# EAGLE design picoPSU-ATX_V2 (EAGLE 7.7.0)
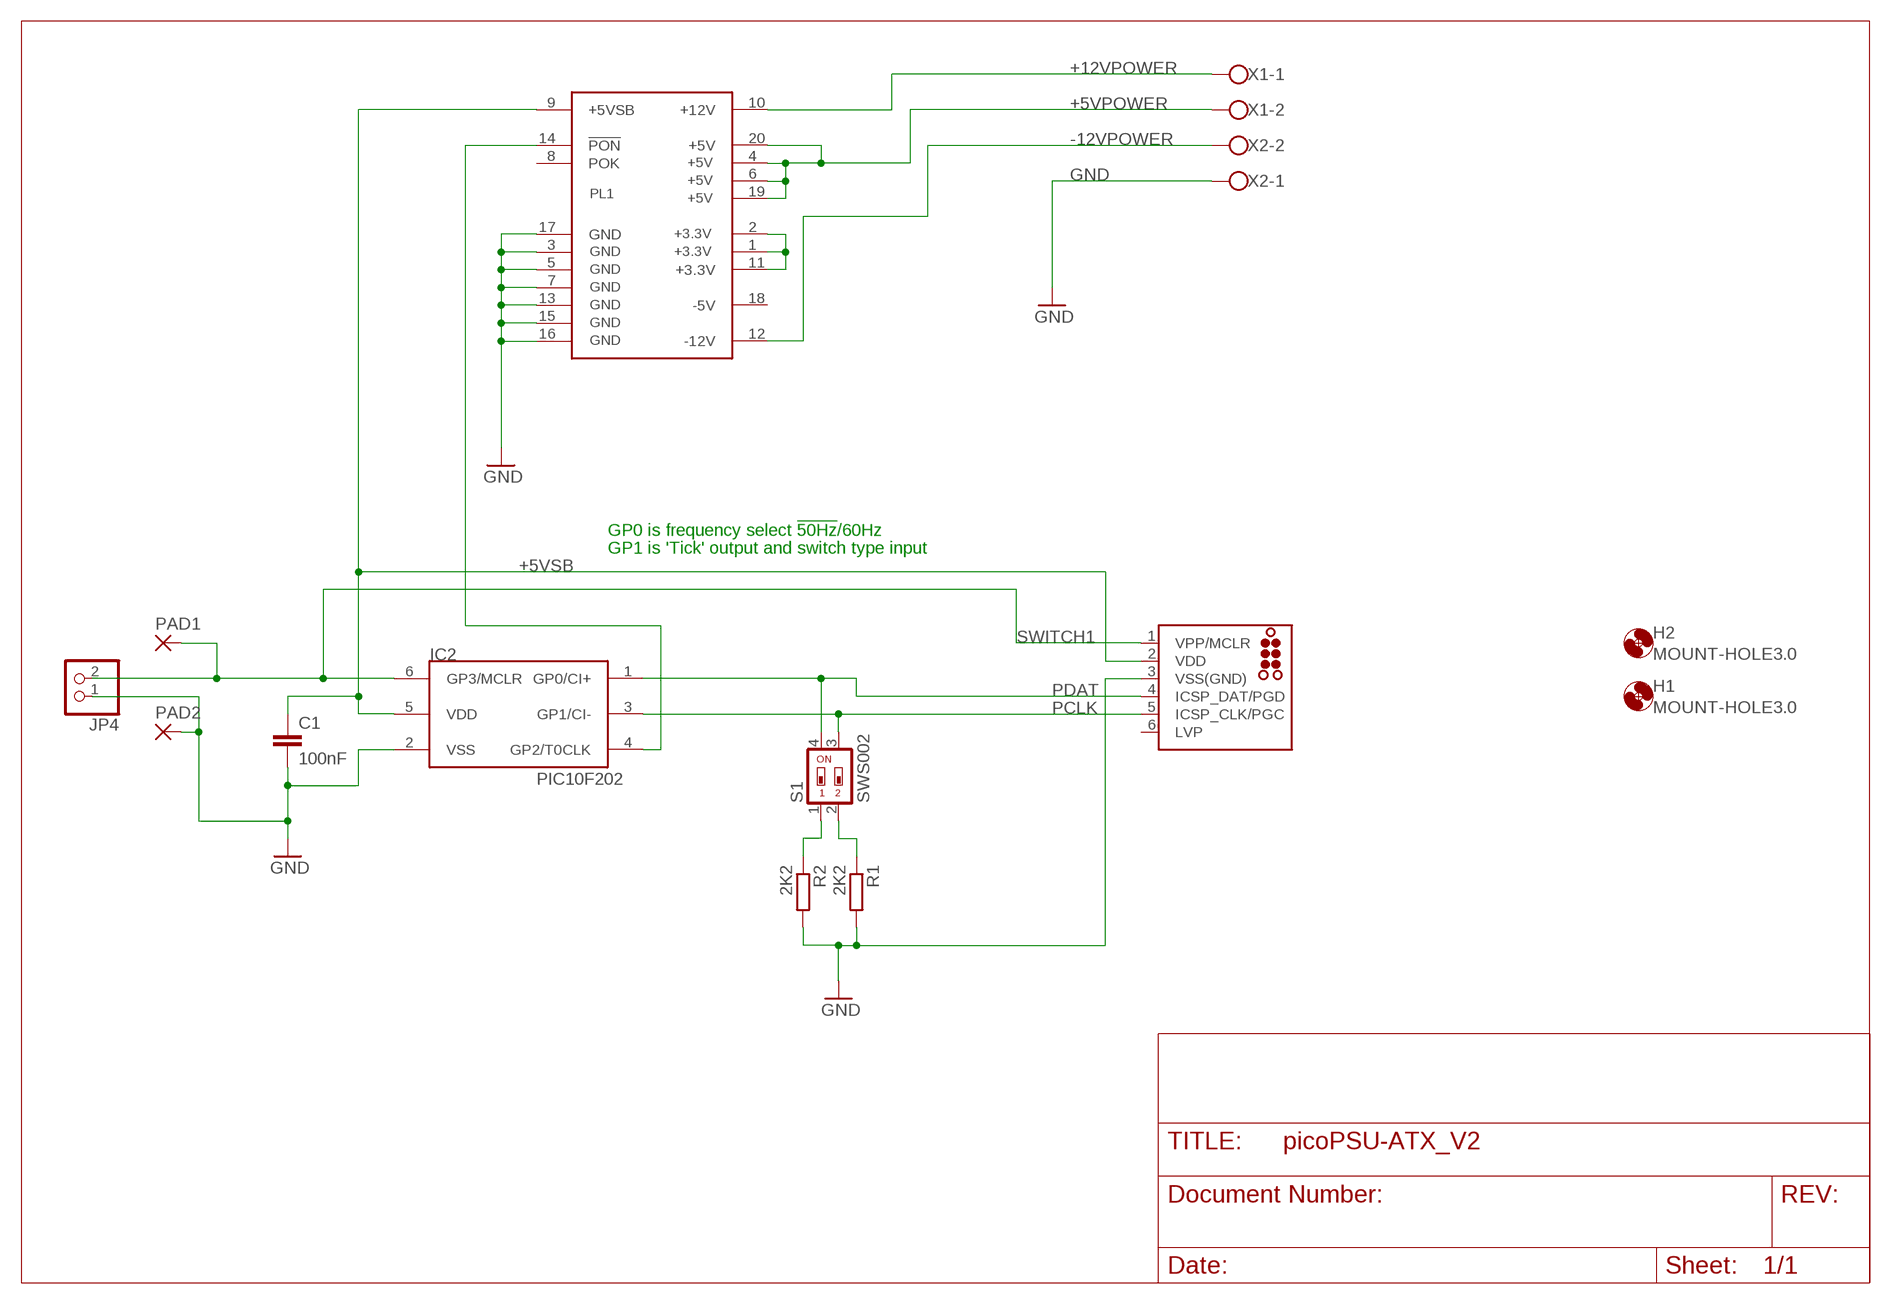
[diagram p0: schematic, sheet 1]

## Parts
C1  100nF  C-EUC0805  [C0805]
H1  MOUNT-HOLE3.0  [3,0]
H2  MOUNT-HOLE3.0  [3,0]
IC2  PIC10F202  PIC10F204OT  [SOT23-6]
J1  TC2030-MCP-NL  [TC2030-MCP-NL]
JP4  PINHD-1X2  [1X02]
PAD1  2,54/1,1  [2,54/1,1]
PAD2  2,54/1,1  [2,54/1,1]
PL1  MOLEX39-30-1200  [ATX_RIGHT]
R1  2K2  R-EU_R0603  [R0603]
R2  2K2  R-EU_R0603  [R0603]
S1  SWS002  [SMS-002]
X1  W237-102  [W237-102]
X2  W237-102  [W237-102]

## Nets
+5VPOWER: PL1.4(+5V) PL1.6(+5V) PL1.19(+5V) PL1.20(+5V) X1.2
+5VSB: C1.1 IC2.5(VDD) J1.2(VDD) PL1.9(+5VSB)
+12VPOWER: PL1.10(+12V) X1.1
-12VPOWER: PL1.12(-12V) X2.2
GND: C1.2 IC2.2(VSS) J1.3(VSS(GND)) JP4.1 PAD2.1(P) PL1.3(GND) PL1.5(GND) PL1.7(GND) PL1.13(GND) PL1.15(GND) PL1.16(GND) PL1.17(GND) R1.2 R2.2 X2.1
N$1: R2.1 S1.1
N$2: R1.1 S1.2
N$4: PL1.1(+3.3V) PL1.2(+3.3V) PL1.11(+3.3V)
PCLK: IC2.3(GP1/CI-) J1.5(ICSP_CLK/PGC) S1.3
PDAT: IC2.1(GP0/CI+) J1.4(ICSP_DAT/PGD) S1.4
PWRON: IC2.4(GP2/T0CLK) PL1.14(!PON)
SWITCH1: IC2.6(GP3/MCLR) J1.1(VPP/MCLR) JP4.2 PAD1.1(P)
Unconnected: J1.6(LVP) PL1.8(POK) PL1.18(-5V)

## Notes on the sheet
- GP0 is frequency select !50Hz!/60Hz
- GP1 is 'Tick' output and switch type input

## Library data of the parts
C1 = rcl:C-EU: CAPACITOR, European symbol
H1 H2 = holes:MOUNT-HOLE: MOUNTING HOLE with drill center marker
IC2 = microchip-5:PIC10F2*: uPC nW 0,25/0,5k Program Flash memory Comparator
J1 = tag-connect:TC2030: TAG-CONNECT ICSP Connector Manufacturer: Tag-Connect <http://www.tag-connect.com> Cable for easy In-Circuit Serial Programming. Designed for Microchip ICD2, suitable for many others. Two variants - one "with legs" (for hands-free fit on PCB) and another "without legs" for quick programming. PAD Description 1 MCLR/Vpp 2 Vdd 3 GND 4 PGD (ISPDAT) 5 PGC (ISPCLK) 6 nc (used for LVP) ©2009 ROFA.cz - modified and updated by Robert Darlington ‹rdarlington@gmail.com›
JP4 = pinhead:PINHD-1X2: PIN HEADER
PAD1 PAD2 = wirepad:2,54/1,1: THROUGH-HOLE PAD
PL1 = IANS:MOLEX39-30-1200
R1 R2 = rcl:R-EU_: RESISTOR, European symbol
S1 = smd-special:SWS002: SMD Dip Switch 2 pol.
X1 X2 = con-wago-500:W237-102: WAGO SCREW CLAMP; MPN: 237-102; OC_FARNELL: unknown; OC_NEWARK: 70K9898

## Board
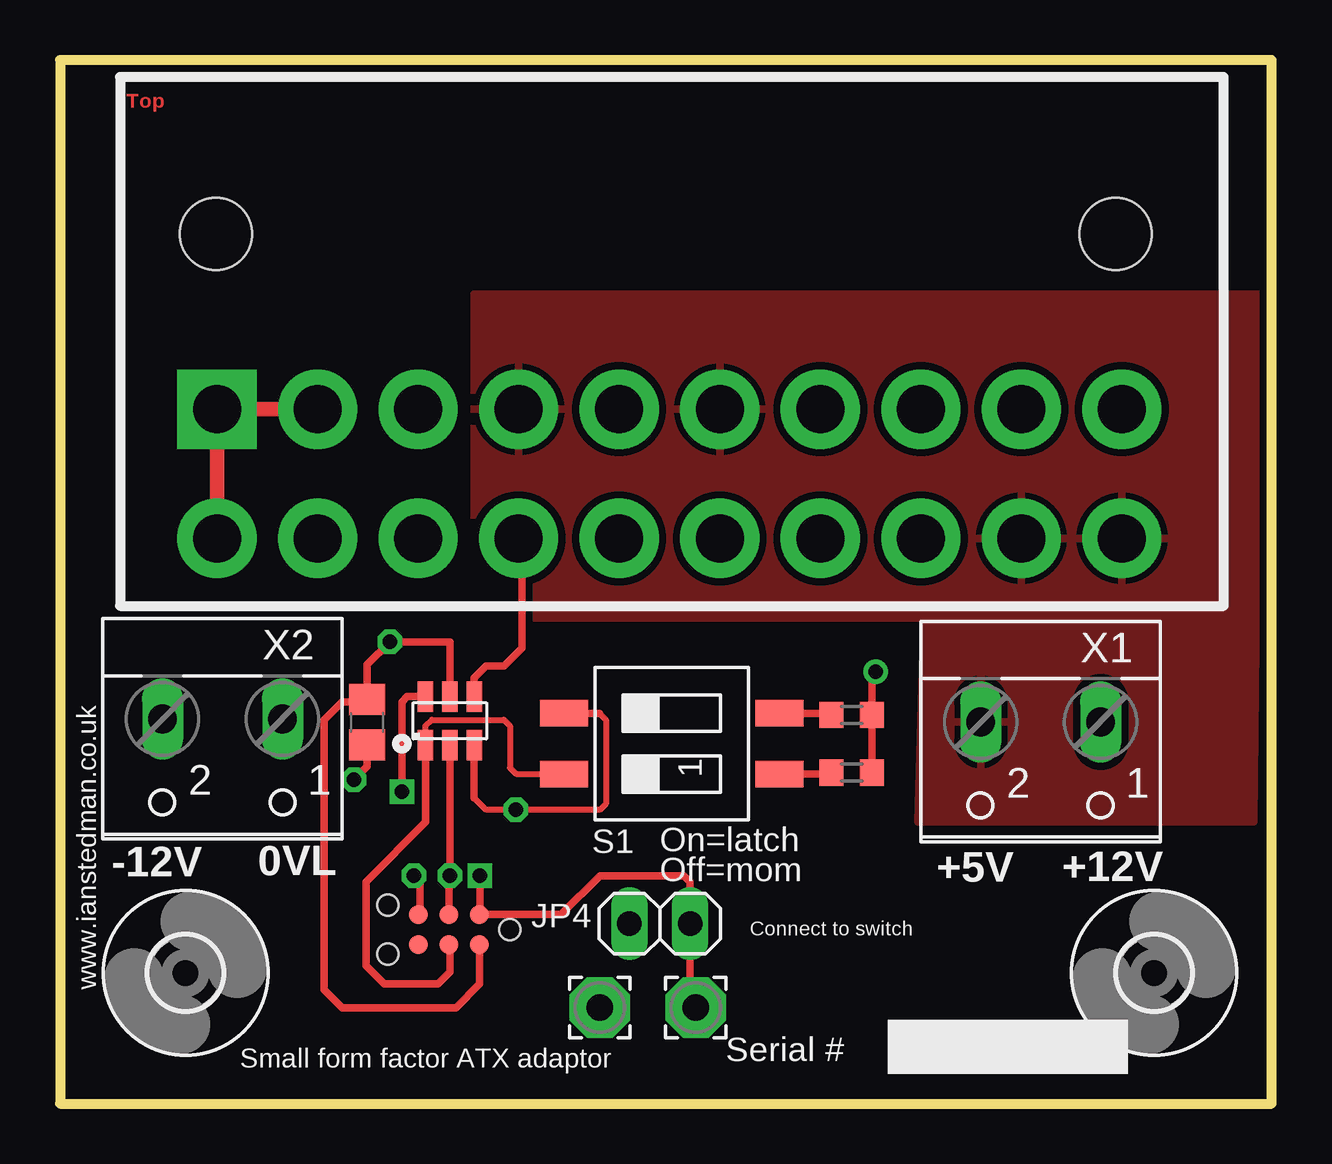
[diagram p1: board, top side]
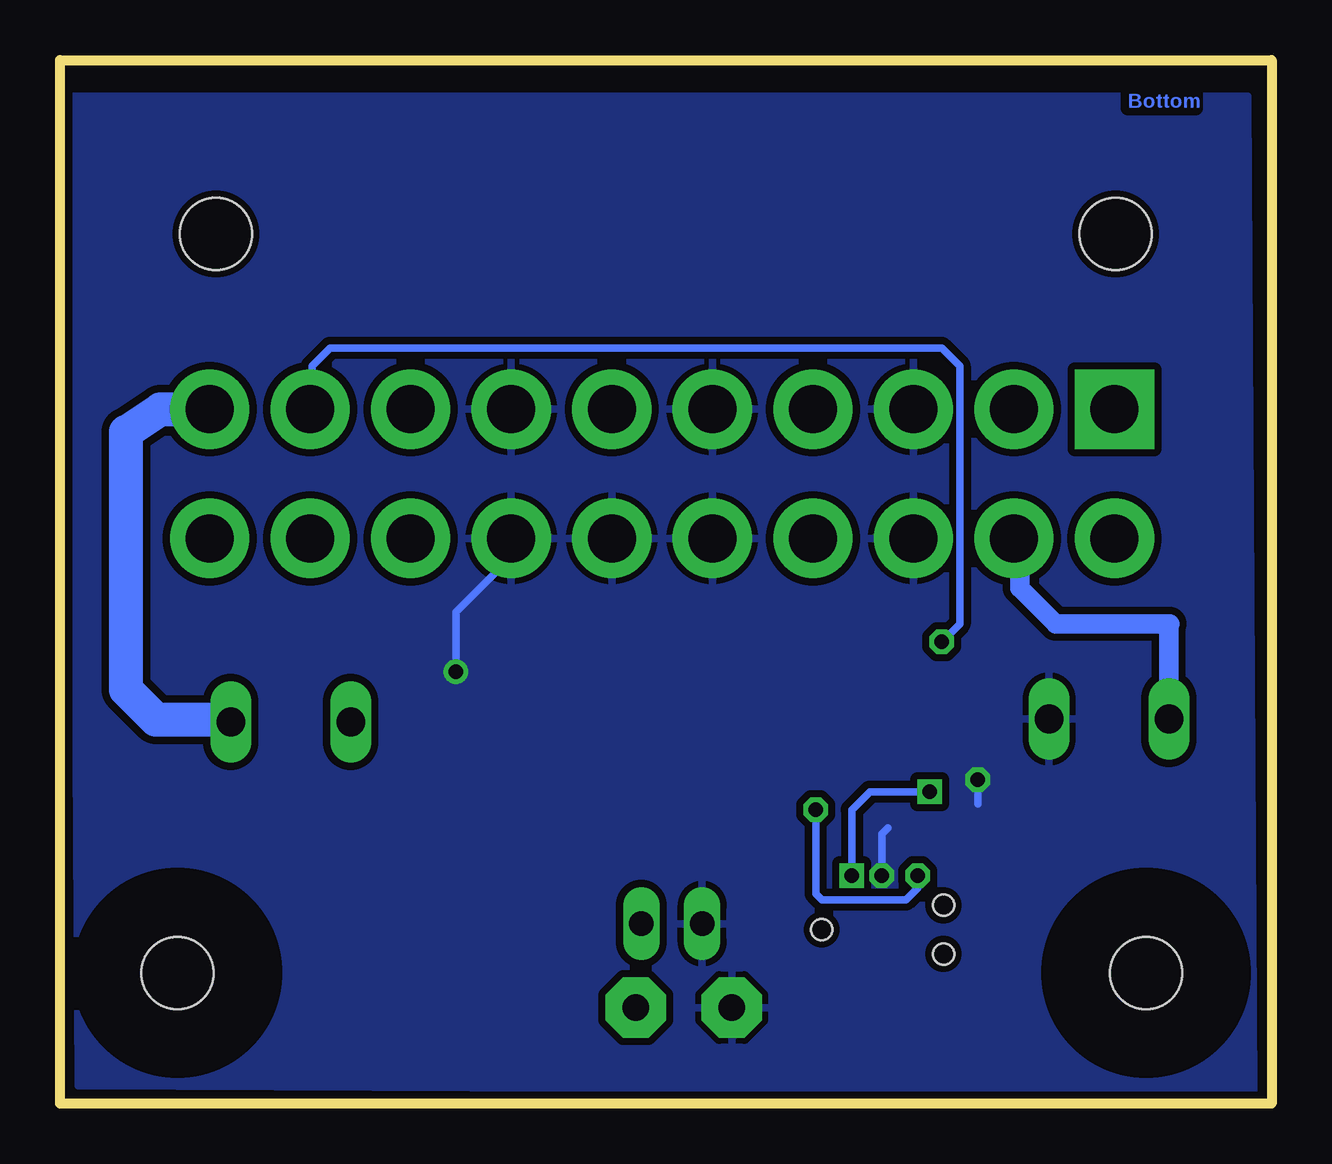
[diagram p2: board, bottom side, seen from below]

Size 50.5 x 43.5 mm. Coordinates in mm from the lower left corner, seen from the top.
Outline: 0,0 50.5,0 50.5,43.5 0,43.5 0,0
Copper layers (1*16): Top 0.0356mm / dielectric 1.5011mm / Bottom 0.0356mm
Design rules "advanced_circuits": minimum track width 0.1499mm, minimum drill 0.2997mm, track to track 0.1499mm, track to pad 0.1499mm, pad to pad 0.1499mm, via to via 0.1499mm, smd to smd 0.1499mm, copper to edge 0.2489mm, drill to drill 0.2489mm, minimum pad ring 5mil, minimum via ring 8mil, stop-mask expansion 0mil, vias tented up to drill 0mil, thermal gap 10mil

### Footprints (pad centres in the part's own frame; a part is rotated, then mirrored left to right if it is on the bottom)
C0805 = smd 1.3 x 1.5: 1 -0.95,0; 2 0.95,0
3,0 = hole 3: 0,0
SOT23-6 = smd 0.635 x 1.27: 1 -1.016,-1.016; 2 0,-1.016; 3 1.016,-1.016; 4 1.016,1.016; 5 0,1.016; 6 -1.016,1.016
TC2030-MCP-NL = smd 0.787 x 0.787: 1 1.27,-0.635; 2 1.27,0.635; 3 2.54,-0.635; 4 2.54,0.635; 5 3.81,-0.635; 6 3.81,0.635 | hole 0.889: 0,0; 5.08,-1.016; 5.08,1.016
1X02 = drill 1.016 long: 1 -1.27,0; 2 1.27,0
2,54/1,1 = drill 1.118 pad 2.54 octagon: 1 0,0
ATX_RIGHT = drill 2 pad 3.302 square: 1 20.955,-3.691 | drill 2 pad 3.302: 2 16.764,-3.691; 3 12.573,-3.691; 4 8.382,-3.691; 5 4.191,-3.691; 6 0,-3.691; 7 -4.191,-3.691; 8 -8.382,-3.691; 9 -12.573,-3.691; 10 -16.764,-3.691; 11 20.955,1.691; 12 16.764,1.691; 13 12.573,1.691; 14 8.382,1.691; 15 4.191,1.691; 16 0,1.691; 17 -4.191,1.691; 18 -8.382,1.691; 19 -12.573,1.691; 20 -16.764,1.691 | hole 3: 21,-11; -16.5,-11
R0603 = smd 1 x 1.1: 1 -0.85,0; 2 0.85,0
SMS-002 = smd 1.092 x 2.007: 1 -1.27,-4.496; 2 1.27,-4.496; 3 1.27,4.496; 4 -1.27,4.496
W237-102 = drill 1.194 long: 1 -2.5,-1.27; 2 2.5,-1.27

### Placement (x,y rotation side)
C1  12.8,15.9 270 top
H1  45.6,5.45 0 top
H2  5.24,5.45 0 top
IC2  16.25,15.95 0 top
J1  18.75,7.25 180 top
JP4  25,7.5 0 top
PAD1  26.5,4 0 top
PAD2  22.5,4 0 top
PL1  27.5,25.25 180 top
R1  33,16.2 0 top
R2  33,13.8 0 top
S1  25.5,15 90 top
X1  40.88,14.64 180 top
X2  6.77,14.76 180 top

### Tracks (layer width: path | path; a pad name or v marks a point on that pad's centre or on a via)
+5VPOWER
  Top 0.813: 38.38,14.88 X1.2
  pour Top (isolate 0.305): 17.25,33.75 17.25,20.25 36,20.25 35.75,11.75 49.75,11.75 50,33.75
+5VSB  (via drill 0.6)
  Top 0.305: IC2.5 16.25,19.25 v13.75,19.25 12.8,18.3 C1.1 12.7,16.75 11.75,16.75 11,16 11,4.75 11.75,4 16.5,4 17.48,4.98 J1.2
  Bottom 0.305: PL1.9 40,29.01 40,30.75 39.25,31.5 13.75,31.5 13,30.75 13,20 v13.75,19.25
+12VPOWER
  Bottom 1.016: X1.1 43.47,16
  Bottom 1.422: PL1.10 46.31,28.94 47.75,28 47.75,17.25 46.5,16 43.47,16
-12VPOWER
  Bottom 0.813: X2.2 4.27,19.98 4.25,20 9,20 10.5,21.5 10.5,23.25 | 10.5,23.25 10.5,23.32 PL1.12 10.74,23.49 10.5,23.25
GND  (via drill 0.6)
  Top 0.305: R2.2 R1.2 33.85,17.85 v34,18 | C1.2 12.8,14.05 v12.25,13.5 | J1.3 16.21,9.46 v16.25,9.5 IC2.2
  Bottom 0.305: v34,18 34,20.5 31.5,23 31.5,23.37 PL1.17 | v12.25,13.5 12.25,12.5 | v16.25,9.5 16.25,11.25 16,11.5
  pour Bottom (isolate 0.305): 1,42 50,42 49.75,0.75 0.75,0.5
N$1
  Top 0.305: S1.1 32.08,13.73 R2.1
N$2
  Top 0.305: S1.2 32.08,16.27 R1.1
N$4
  Top 0.61: PL1.11 PL1.1 PL1.2
PCLK  (via drill 0.6)
  Top 0.254: 22.48,16.27 22.75,16 22.75,12.5 22.5,12.25 19.25,12.25 | v19,12.25 17.77,12.25 17.27,12.75
  Top 0.305: 17.27,12.75 IC2.3 17.45,14.75 | J1.5 15,7.95 15,9.25 v14.75,9.5 | v19,12.25 19.25,12.25 | 22.48,16.27 S1.3
  Bottom 0.305: v14.75,9.5 14.75,9 15.25,8.5 18.75,8.5 19,8.75 v19,12.25
PDAT
  Top 0.254: IC2.1 15.23,15.73 15.5,16 18.5,16 18.75,15.75 18.75,14 19,13.75 20.98,13.75 S1.4
  Top 0.305: IC2.1 15.23,11.73 12.75,9.25 12.75,5.75 13.5,5 15.75,5 16.25,5.5 16.25,6.57 J1.4
PWRON
  Top 0.305: PL1.14 19.25,23.43 19.25,19 18.5,18.25 17.75,18.25 17.25,17.75 17.25,16.98 IC2.4
SWITCH1  (via drill 0.6)
  Top 0.305: IC2.6 14.47,16.97 14.25,16.75 v14.25,13 | v17.5,9.5 17.5,7.9 J1.1 20.89,7.88 22.5,9.5 26,9.5 26.25,9.25 26.25,7.52 JP4.2 26.27,4.48 PAD1.1
  Bottom 0.305: v14.25,13 16.75,13 17.5,12.25 v17.5,9.5

### Text on the board
Top: Top
Bottom: Bottom
tPlace: On=latch | +5V | -12V | 0VL | Off=mom | +12V | Connect to switch | www.ianstedman.co.uk | Serial # | Small form factor ATX adaptor
Document: IC2